# Altium schematic sheet MCU.SchDoc
size A4; SheetNumber: 10; SheetTotal: 10
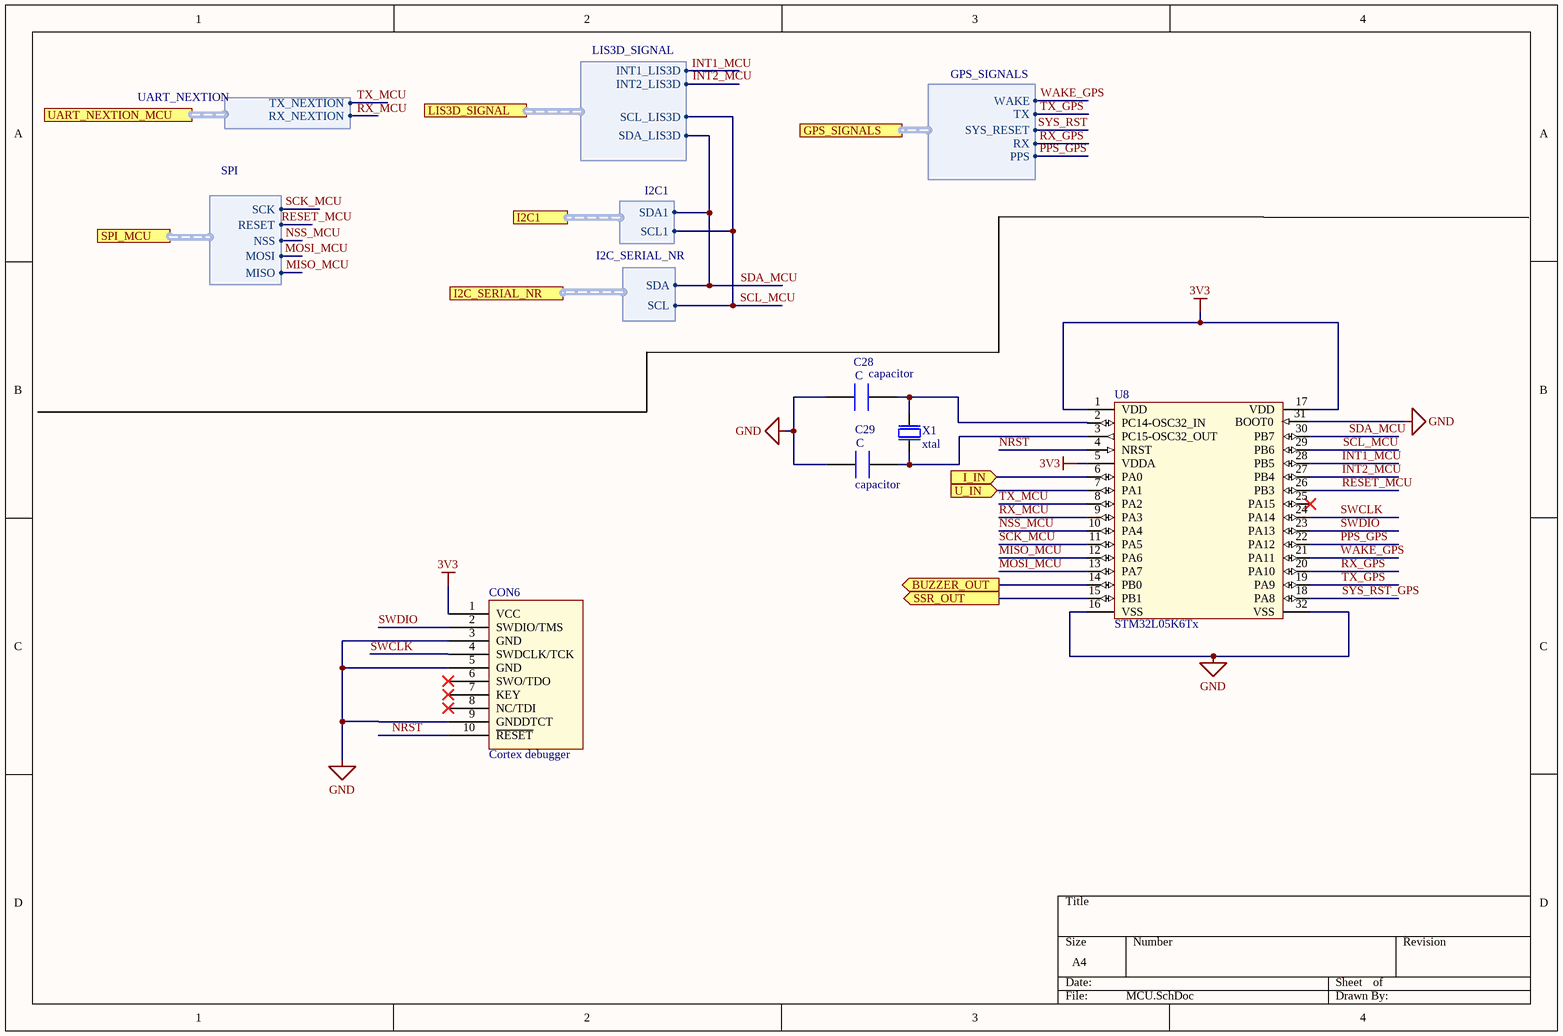
[diagram p0: MCU.SchDoc]

## Parts
C28  capacitor  [CAPC1005X04L]
C29  capacitor  [CAPC1005X04L]
CON6  Cortex debugger  [Jtag header]
U8  STM32L05K6Tx
X1  xtal  [BT-XTAL_2016]

## Ports
BUZZER_OUT (out), GPS_SIGNALS (harness GPS_SIGNALS), I2C1 (harness I2C1), I2C_SERIAL_NR (harness I2C_SERIAL_NR), I_IN (in), LIS3D_SIGNAL (harness LIS3D_SIGNAL), SPI_MCU (harness SPI), SSR_OUT (out), U_IN (in), UART_NEXTION_MCU (harness UART_NEXTION)

## Harnesses
UART_NEXTION: RX_NEXTION, TX_NEXTION
SPI: MISO, MOSI, NSS, RESET, SCK
LIS3D_SIGNAL: INT1_LIS3D, INT2_LIS3D, SCL_LIS3D, SDA_LIS3D
I2C1: SCL1, SDA1
I2C_SERIAL_NR: SCL, SDA
GPS_SIGNALS: PPS, RX, SYS_RESET, TX, WAKE

## Nets
3V3: CON6.1(VCC) U8.1(VDD) U8.5(VDDA) U8.17(VDD)
GND: C28.2 C29.2 CON6.3(GND) CON6.5(GND) CON6.9(GNDDTCT) U8.16(VSS) U8.31(BOOT0) U8.32(VSS)
BUZZER_OUT: U8.14(PB0) ; port BUZZER_OUT
I_IN: U8.6(PA0) ; port I_IN
INT1_MCU: U8.28(PB5)
INT2_MCU: U8.27(PB4) ; port LIS3D_SIGNAL.INT2_LIS3D
MISO_MCU: U8.12(PA6) ; port SPI_MCU.MISO
MOSI_MCU: U8.13(PA7) ; port SPI_MCU.MOSI
NRST: CON6.10(~{RESET}) U8.4(NRST)
NSS_MCU: U8.10(PA4) ; port SPI_MCU.NSS
PPS_GPS: U8.22(PA12) ; port GPS_SIGNALS.PPS
RESET_MCU: U8.26(PB3) ; port SPI_MCU.RESET
RX_GPS: U8.20(PA10) ; port GPS_SIGNALS.RX
RX_MCU: U8.9(PA3) ; harness UART_NEXTION.RX_NEXTION
SCK_MCU: U8.11(PA5) ; port SPI_MCU.SCK
SCL_MCU: U8.29(PB6) ; port LIS3D_SIGNAL.SCL_LIS3D, port I2C1.SCL1, port I2C_SERIAL_NR.SCL
SDA_MCU: U8.30(PB7) ; port LIS3D_SIGNAL.SDA_LIS3D, port I2C1.SDA1, port I2C_SERIAL_NR.SDA
SSR_OUT: U8.15(PB1) ; port SSR_OUT
SWCLK: CON6.4(SWDCLK/TCK) U8.24(PA14)
SWDIO: CON6.2(SWDIO/TMS) U8.23(PA13)
SYS_RST: port GPS_SIGNALS.SYS_RESET
SYS_RST_GPS: U8.18(PA8)
TX_GPS: U8.19(PA9) ; port GPS_SIGNALS.TX
TX_MCU: U8.8(PA2) ; harness UART_NEXTION.TX_NEXTION
U_IN: U8.7(PA1) ; port U_IN
WAKE_GPS: U8.21(PA11) ; port GPS_SIGNALS.WAKE
NetC28_1: C28.1 U8.2(PC14-OSC32_IN) X1.3(out)
NetC29_1: C29.1 U8.3(PC15-OSC32_OUT) X1.1(inp)

Not connected (* = marked no-connect by the designer): CON6 6(SWO/TDO)* 7(KEY)* 8(NC/TDI)*; U8 25(PA15)*

## Notes on the sheet
- Labels drawn without touching a wire or pin: INT1_MCU
- (in symbol capacitor) C